# EAGLE design 8x8_matrix (EAGLE 8.2.2)
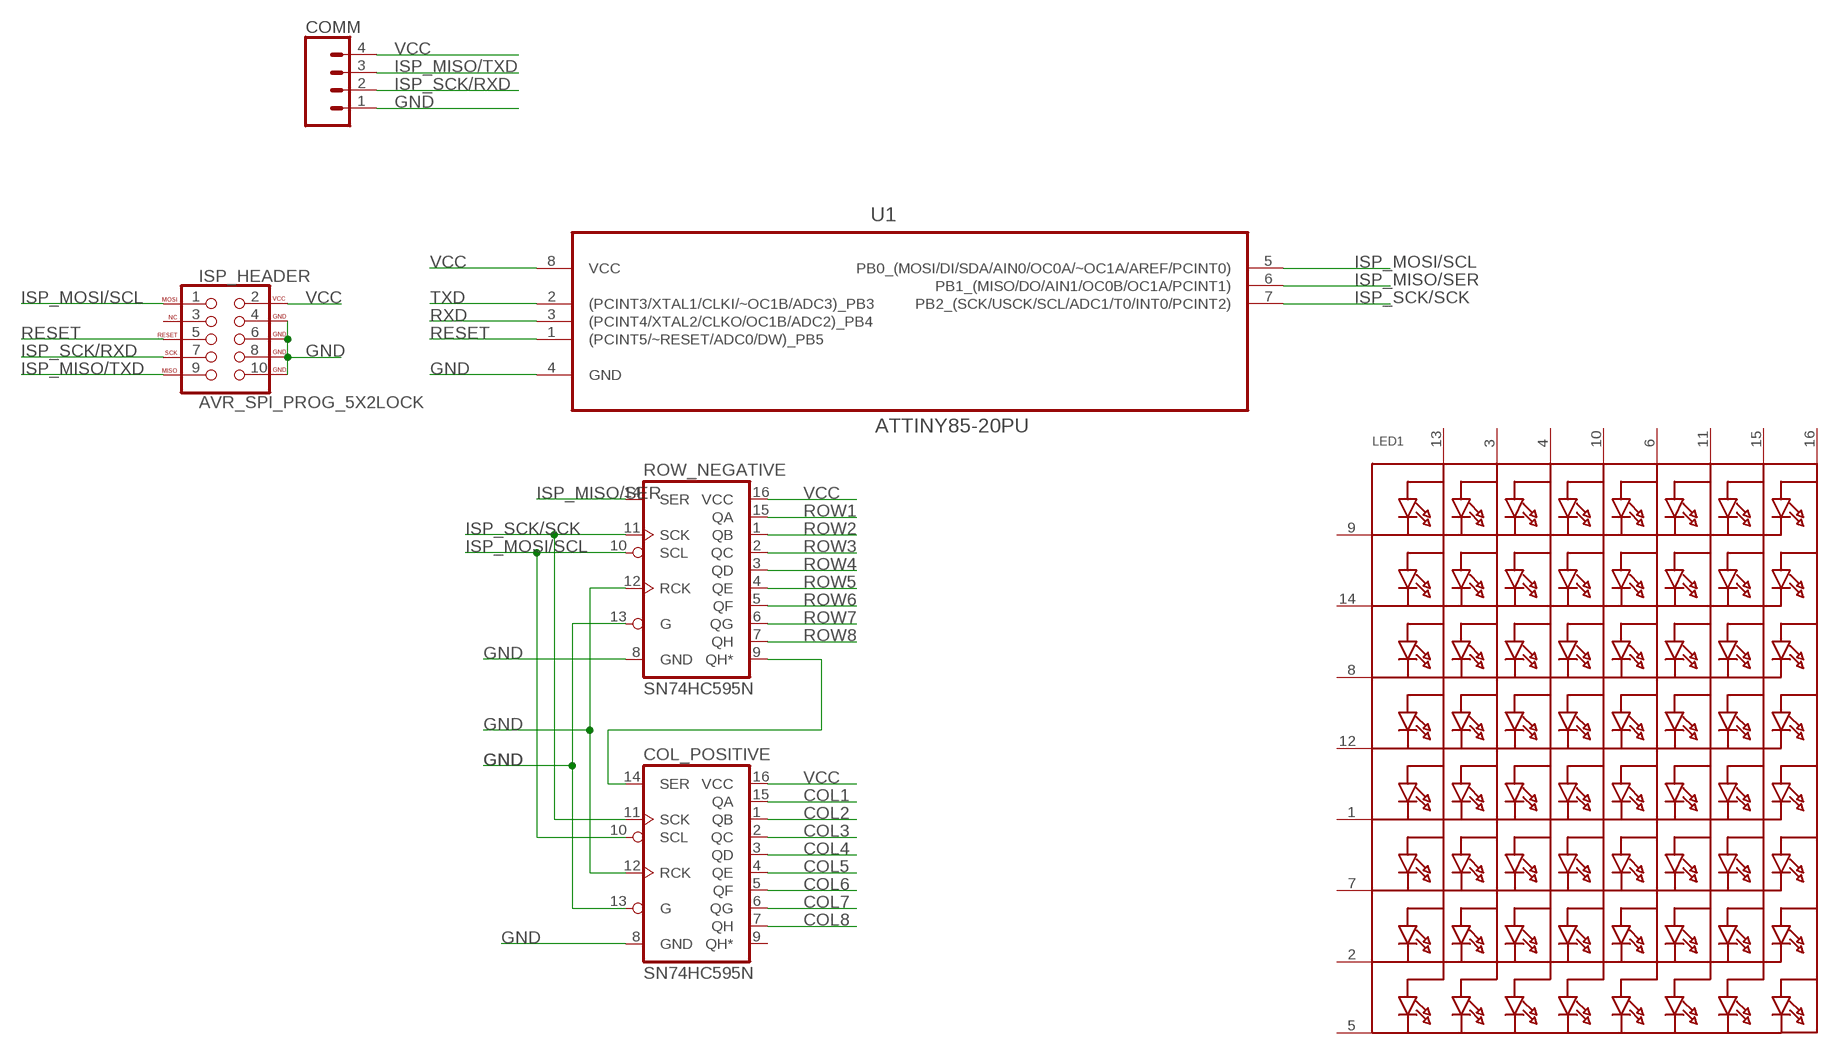
[diagram p0: schematic, sheet 1]

## Parts
COL_POSITIVE  SN74HC595N  74HC595N  [DIP16]
COMM  CONN_04POLAR  [MOLEX-1X4]
ISP_HEADER  AVR_SPI_PROG_5X2LOCK  [2X5-SHROUDED_LOCK]
LED1  SEGMENT_8X8_ROWCATHODEM12A881UR  [SEGMENT_BL-M12A881UR]
ROW_NEGATIVE  SN74HC595N  74HC595N  [DIP16]
U1  ATTINY85-20PU  [DIP254P762X533-8]

## Nets
COL1: COL_POSITIVE.15(QA)
COL2: COL_POSITIVE.1(QB)
COL3: COL_POSITIVE.2(QC)
COL4: COL_POSITIVE.3(QD)
COL5: COL_POSITIVE.4(QE)
COL6: COL_POSITIVE.5(QF)
COL7: COL_POSITIVE.6(QG)
COL8: COL_POSITIVE.7(QH)
GND: COL_POSITIVE.8(GND) COL_POSITIVE.12(RCK) COL_POSITIVE.13(G) COMM.1 ISP_HEADER.4(GND) ISP_HEADER.6(GND) ISP_HEADER.8(GND) ISP_HEADER.10(GND) ROW_NEGATIVE.8(GND) ROW_NEGATIVE.12(RCK) ROW_NEGATIVE.13(G) U1.4(GND)
ISP_MISO/SER: ROW_NEGATIVE.14(SER) U1.6(PB1_(MISO/DO/AIN1/OC0B/OC1A/PCINT1))
ISP_MISO/TXD: COMM.3 ISP_HEADER.9(MISO)
ISP_MOSI/SCL: COL_POSITIVE.10(SCL) ISP_HEADER.1(MOSI) ROW_NEGATIVE.10(SCL) U1.5(PB0_(MOSI/DI/SDA/AIN0/OC0A/~OC1A/AREF/PCINT0))
ISP_SCK/RXD: COMM.2 ISP_HEADER.7(SCK)
ISP_SCK/SCK: COL_POSITIVE.11(SCK) ROW_NEGATIVE.11(SCK) U1.7(PB2_(SCK/USCK/SCL/ADC1/T0/INT0/PCINT2))
N$3: COL_POSITIVE.14(SER) ROW_NEGATIVE.9(QH*)
RESET: ISP_HEADER.5(RESET) U1.1((PCINT5/~RESET/ADC0/DW)_PB5)
ROW1: ROW_NEGATIVE.15(QA)
ROW2: ROW_NEGATIVE.1(QB)
ROW3: ROW_NEGATIVE.2(QC)
ROW4: ROW_NEGATIVE.3(QD)
ROW5: ROW_NEGATIVE.4(QE)
ROW6: ROW_NEGATIVE.5(QF)
ROW7: ROW_NEGATIVE.6(QG)
ROW8: ROW_NEGATIVE.7(QH)
RXD: U1.3((PCINT4/XTAL2/CLKO/OC1B/ADC2)_PB4)
TXD: U1.2((PCINT3/XTAL1/CLKI/~OC1B/ADC3)_PB3)
VCC: COL_POSITIVE.16(VCC) COMM.4 ISP_HEADER.2(VCC) ROW_NEGATIVE.16(VCC) U1.8(VCC)
Unconnected: COL_POSITIVE.9(QH*) ISP_HEADER.3(NC) LED1.1(K5) LED1.2(K7) LED1.3(A2) LED1.4(A3) LED1.5(K8) LED1.6(A5) LED1.7(K6) LED1.8(K3) LED1.9(K1) LED1.10(A4) LED1.11(A6) LED1.12(K4) LED1.13(A1) LED1.14(K2) LED1.15(A7) LED1.16(A8)

## Library data of the parts
COL_POSITIVE ROW_NEGATIVE = SparkFun-IC-Logic:74*595: 8-Bit Shift Register (Serial to Parallel) Datasheet <http://cdn.sparkfun.com/datasheets/BreakoutBoards/MM74HC595.pdf> SparkFun Products SparkFun Shift Register Breakout - 74HC595 <https://www.sparkfun.com/products/10680> (BOB-10680); PROD_ID: IC-13123
COMM = SparkFun-Connectors:CONN_04: Multi connection point. Often used as Generic Header-pin footprint for 0.1 inch spaced/style header connections On any of the 0.1 inch spaced packages, you can populate with these: Break Away Headers - Straight <https://www.sparkfun.com/products/116> (PRT-00116) Break Away Male Headers - Right Angle <https://www.sparkfun.com/products/553> (PRT-00553) Female Headers <https://www.sparkfun.com/products/115> (PRT-00115) Break Away Headers - Machine Pin <https://www.sparkfun.com/products/117> (PRT-00117) Break Away Female Headers - Swiss Machine Pin <https://www.sparkfun.com/products/743> (PRT-00743) For SCREWTERMINALS and SPRING TERMINALS visit here: Screw Terimnals on SparkFun.com <https://www.sparkfun.com/search/results?term=Screw+Terminals> (5mm/3.5mm/2.54mm spacing) This device is also useful as a general connection point to wire up your design to another part of your project. Our various solder wires solder well into these plated through hole pads. Hook-Up Wire - Assortment (Stranded, 22 AWG) <https://www.sparkfun.com/products/11375> (PRT-11375) Hook-Up Wire - Assortment (Solid Core, 22 AWG) <https://www.sparkfun.com/products/11367> (PRT-11367) View the entire wire category on our website here <https://www.sparkfun.com/categories/141> Special notes: Molex polarized connector foot print use with SKU : PRT-08231 with associated crimp pins and housings. 1MM SMD Version SKU: PRT-10208; PROD_ID: CONN-08186; SF_ID: PRT-08231
ISP_HEADER = SparkFun-Connectors:AVR_SPI_PROG_5X2: AVR 10-pin ICSP Header This is the standard AVR In Circuit Serial Programming header. Minimal, but includes pin one indicator. Works with standard Olimex programmers. SparkFun Products: 2x5 AVR ICSP Male Header <https://www.sparkfun.com/products/778> - PTH 2x5 Pin Shrouded Header <https://www.sparkfun.com/products/8506> - PTH2; PROD_ID: CONN-08671; SF_ID: PRT-08506
LED1 = adafruit:SEGMENT_8X8_ROWCATHODE: 8x8 LED Segment Displays: Row = Cathode 0.7" Red 8X8 Matrix, 1.9mm Round LEDs - BL-M07C881UR 1.2" Red 8x8 Matrix, 3.0mm Round LEDs - BL-M12A881UR 1.2" Red 8x8 Matrix, 3.0mm Square LEDs - BL-M12A883
U1 = Atmel_By_element14_Batch_1-00:ATTINY85-20PU: 8-bit Microcontroller with In-System Programmable Flash; MPN: ATTINY85-20PU; OC_FARNELL: 1455162; OC_NEWARK: 58M3796; PACKAGE: PDIP-8; SUPPLIER: Atmel

## Board
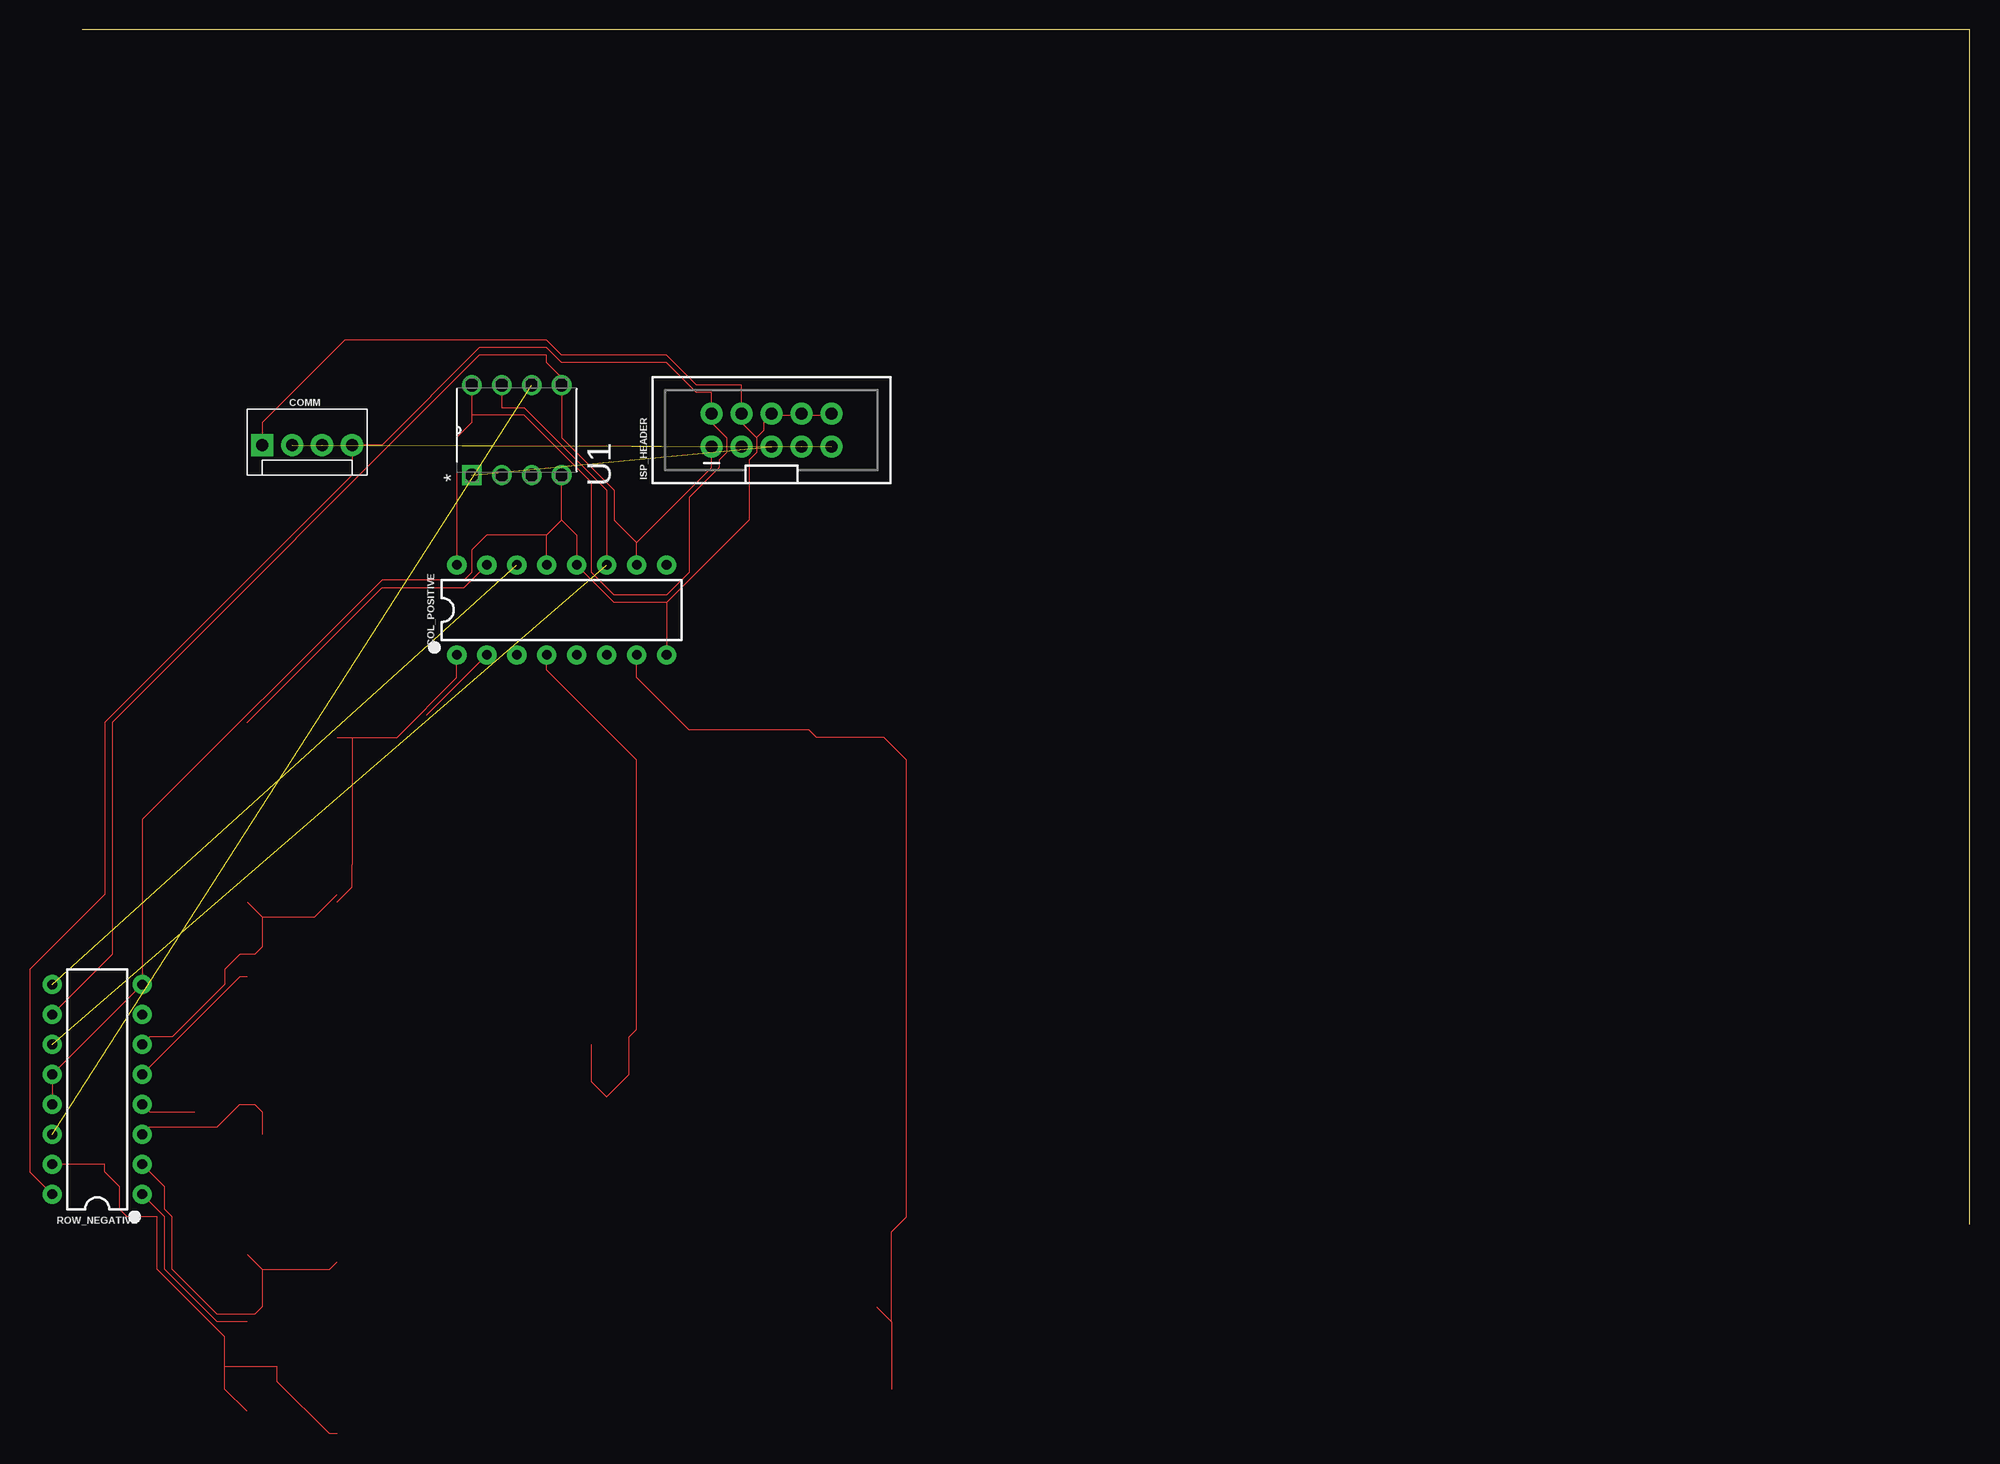
[diagram p1: board, top side]
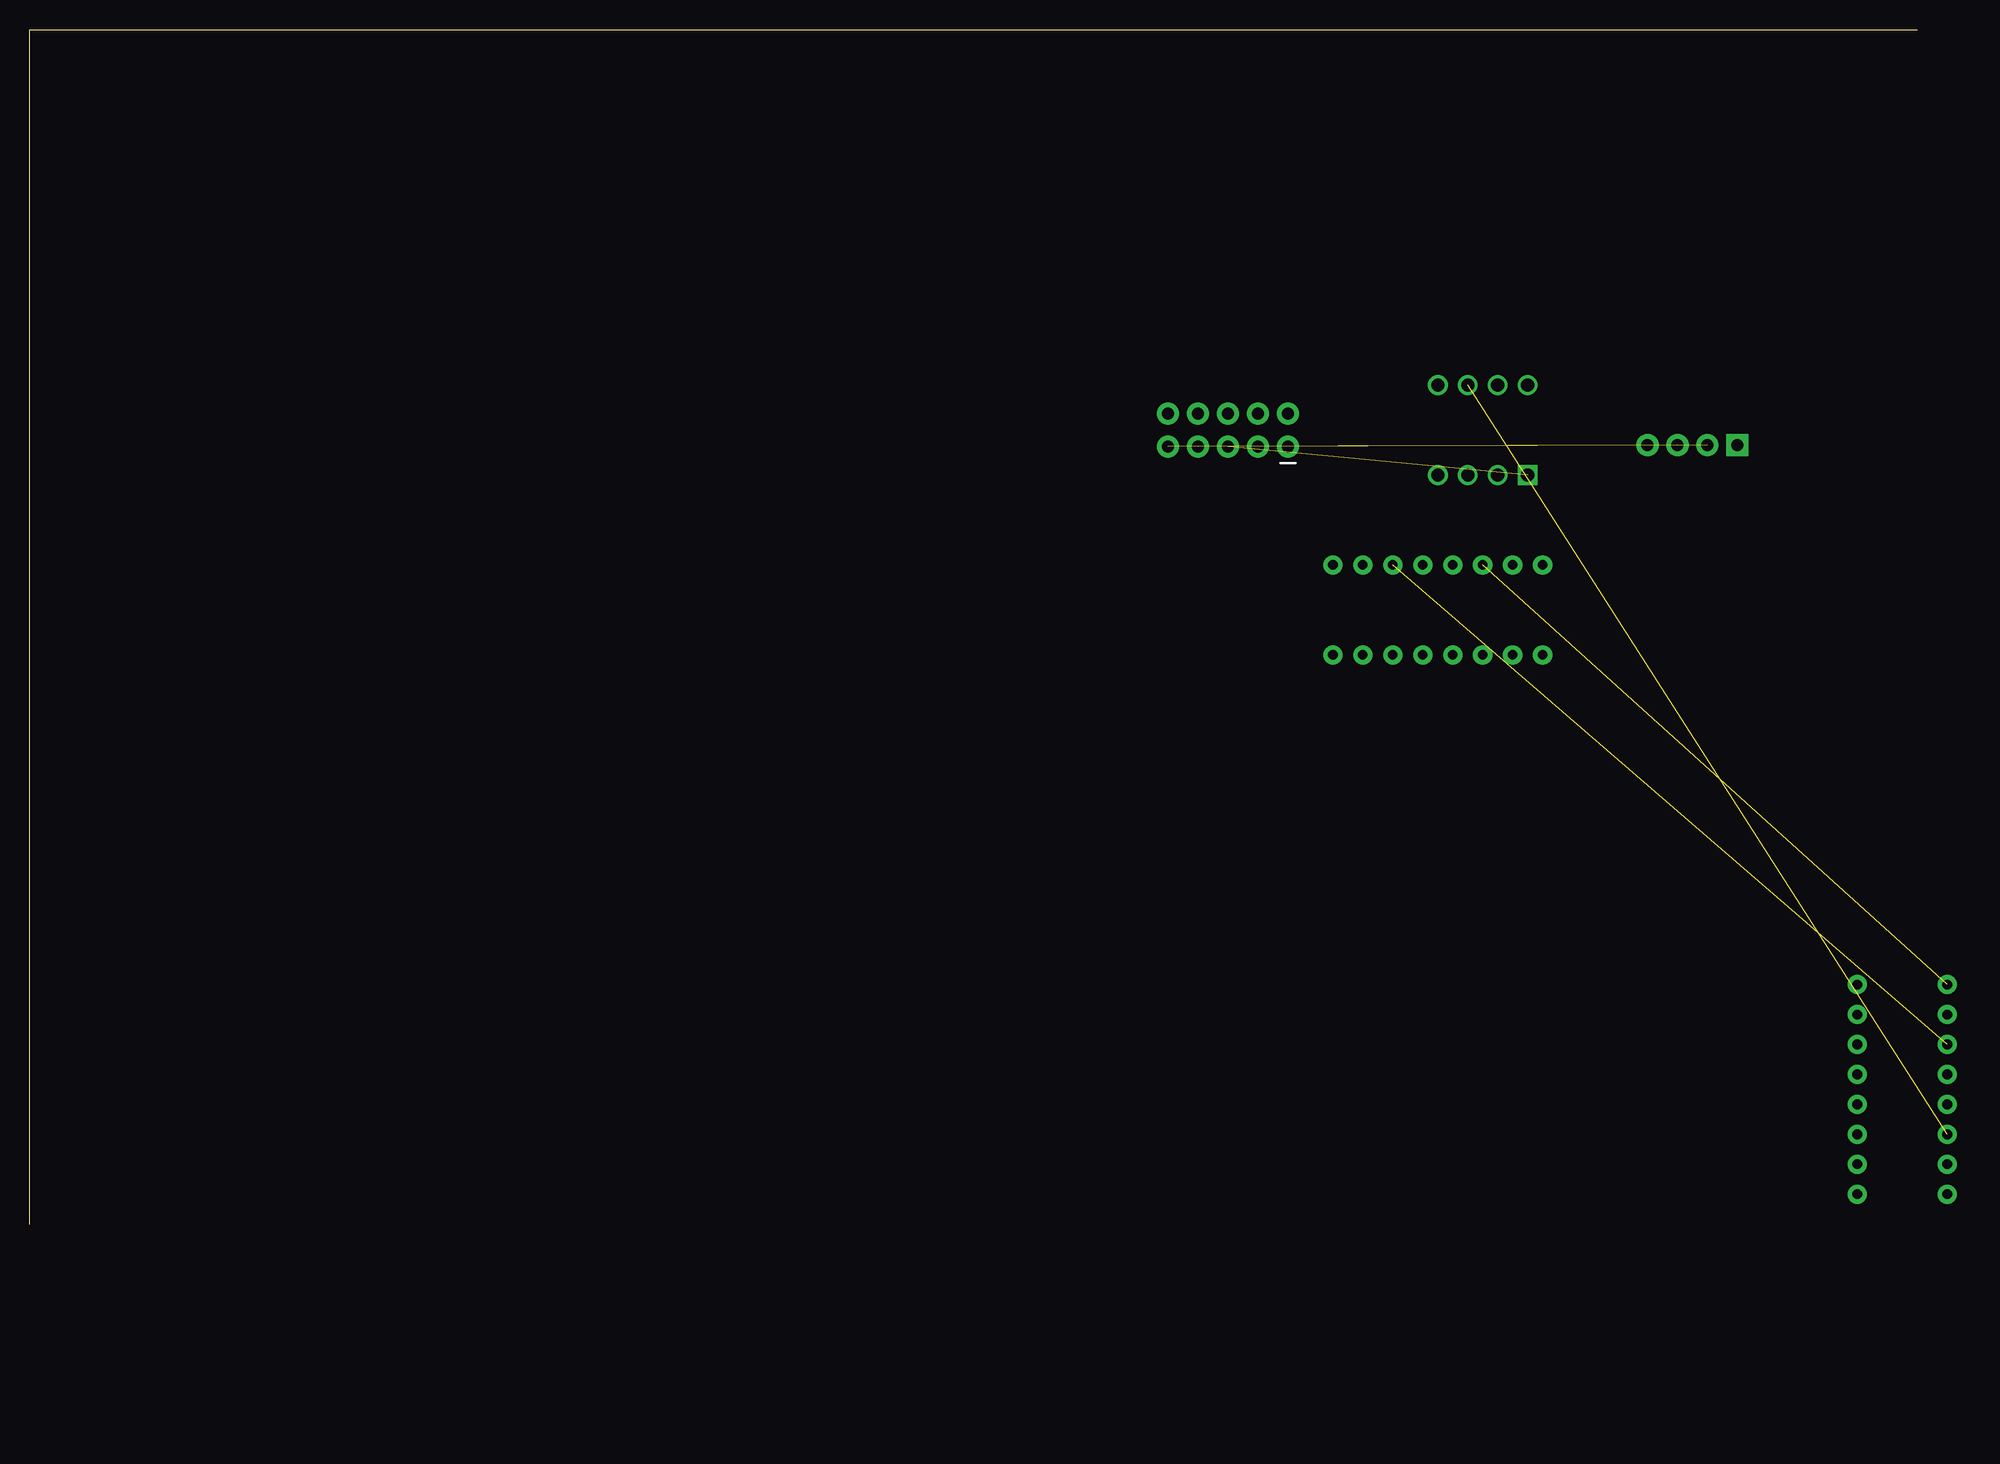
[diagram p2: board, bottom side, seen from below]

Size 160 x 101.27 mm. Coordinates in mm from the lower left corner, seen from the top.
Outline: 160,0 160,101.27 0,101.27
Copper layers (1*16): Top 0.035mm / dielectric 1.5mm / Bottom 0.035mm
Design rules "default *": minimum track width 1mil, minimum drill 24mil, track to track 1mil, track to pad 8mil, pad to pad 8mil, via to via 8mil, smd to smd 8mil, copper to edge 1mm, drill to drill 8mil, minimum pad ring 10mil, minimum via ring 8mil, stop-mask expansion 4mil, vias tented up to drill 0mil, thermal gap 10mil

### Footprints (pad centres in the part's own frame; a part is rotated, then mirrored left to right if it is on the bottom)
DIP16 = drill 0.813 pad 1.626: 1 -8.89,-3.81; 2 -6.35,-3.81; 3 -3.81,-3.81; 4 -1.27,-3.81; 5 1.27,-3.81; 6 3.81,-3.81; 7 6.35,-3.81; 8 8.89,-3.81; 9 8.89,3.81; 10 6.35,3.81; 11 3.81,3.81; 12 1.27,3.81; 13 -1.27,3.81; 14 -3.81,3.81; 15 -6.35,3.81; 16 -8.89,3.81
MOLEX-1X4 = drill 1.016 pad 1.88 square: 1 0,0 | drill 1.016 pad 1.88: 2 2.54,0; 3 5.08,0; 4 7.62,0
2X5-SHROUDED_LOCK = drill 1.016 pad 1.88: 1 -1.397,5.08; 2 1.397,5.08; 3 -1.397,2.54; 4 1.397,2.54; 5 -1.397,0; 6 1.397,0; 7 -1.397,-2.54; 8 1.397,-2.54; 9 -1.397,-5.08; 10 1.397,-5.08
SEGMENT_BL-M12A881UR = drill 0.8 pad 1.676: 1 -8.89,-12; 2 -6.35,-12; 3 -3.81,-12; 4 -1.27,-12; 5 1.27,-12; 6 3.81,-12; 7 6.35,-12; 8 8.89,-12; 9 8.89,12; 10 6.35,12; 11 3.81,12; 12 1.27,12; 13 -1.27,12; 14 -3.81,12; 15 -6.35,12; 16 -8.89,12
DIP254P762X533-8 = drill 1.118 square: 1 -7.62,7.62 | drill 1.118: 2 -7.62,5.08; 3 -7.62,2.54; 4 -7.62,0; 5 0,0; 6 0,2.54; 7 0,5.08; 8 0,7.62

### Placement (x,y rotation side)
COL_POSITIVE  40.64,52.07 0 top
COMM  15.24,66.04 0 top
ISP_HEADER  58.42,67.31 90 top
LED1  -27.94,-5.08 0 top  (outside the outline)
ROW_NEGATIVE  1.27,11.43 90 top
U1  40.64,71.12 90 top

### Tracks (layer width: path | path; a pad name or v marks a point on that pad's centre or on a via)
COL1
  Top 0.025: COL_POSITIVE.15 32.38,53.98 25.4,53.98 13.97,42.55
COL2
  Top 0.025: 21.59,27.3 22.86,28.57 22.86,30.48 22.86,41.28 | COL_POSITIVE.1 31.75,46.36 26.67,41.28 22.86,41.28 | 21.59,41.28 22.86,41.28
COL3
  Top 0.025: 29.21,43.18 COL_POSITIVE.2
COL5
  Top 0.025: COL_POSITIVE.4 39.37,46.99 46.99,39.37 46.99,16.51 46.35,15.88 46.35,12.7 44.45,10.79 43.18,12.06 43.18,15.24
COL8
  Top 0.025: 68.58,-8.26 68.58,-13.97 | 67.31,-6.99 68.58,-8.26 | COL_POSITIVE.7 46.99,46.36 51.44,41.91 61.59,41.91 62.23,41.28 67.94,41.28 69.85,39.37 69.85,0.64 68.58,-0.64 68.58,-8.26
GND
  Top 0.025: ROW_NEGATIVE.13 ROW_NEGATIVE.12 -2.54,13.33 -1.91,13.33 ROW_NEGATIVE.8 5.08,34.29 25.4,54.61 32.38,54.61 33.02,55.25 33.02,57.15 34.29,58.42 39.37,58.42 | 40.64,59.69 U1.4 | 39.37,58.42 40.64,59.69 | COL_POSITIVE.13 39.37,58.42 | 40.64,59.69 41.91,58.42 COL_POSITIVE.12 45.09,52.71 49.53,52.71 | 49.53,52.71 COL_POSITIVE.8 | 49.53,52.71 56.52,59.69 56.52,64.77 57.15,65.41 57.15,66.67 | 57.15,66.67 55.88,67.94 ISP_HEADER.4 55.88,71.12 52.07,71.12 49.53,73.66 40.64,73.66 39.37,74.93 22.23,74.93 15.24,67.94 COMM.1 | 58.42,68.58 57.78,67.94 57.78,67.31 57.15,66.67 | 58.42,68.58 60.96,68.58 | 58.42,68.58 ISP_HEADER.6 | 60.96,68.58 63.5,68.58 ISP_HEADER.10 | 60.96,68.58 ISP_HEADER.8
ISP_MISO/SER  (1 unrouted)
ISP_MISO/TXD  (1 unrouted)
ISP_MOSI/SCL
  Top 0.025: ISP_HEADER.1 53.34,64.14 46.99,57.79 | COL_POSITIVE.10 46.99,57.79 | ROW_NEGATIVE.10 2.54,22.86 2.54,42.55 33.66,73.66 39.37,73.66 39.37,73.02 40.64,71.75 U1.5 40.64,66.67 45.09,62.23 45.09,59.69 46.99,57.79
ISP_SCK/RXD  (1 unrouted)
ISP_SCK/SCK  (1 unrouted)
  Top 0.025: COL_POSITIVE.11 44.45,62.23 37.47,69.21 35.56,69.21 U1.7
N$3  (1 unrouted)
RESET  (1 unrouted)
ROW1
  Top 0.025: ROW_NEGATIVE.15 1.91,5.08 1.91,4.45 3.17,3.17 3.17,1.27 3.81,0.64 6.35,0.64 6.35,-3.81 12.06,-9.53 12.06,-12.07 | 12.06,-12.07 12.06,-13.97 13.97,-15.88 | 12.06,-12.07 16.51,-12.07 16.51,-13.34 20.95,-17.78 21.59,-17.78
ROW2
  Top 0.025: ROW_NEGATIVE.1 6.99,0.64 6.99,-3.81 11.43,-8.26 13.97,-8.26
ROW3
  Top 0.025: ROW_NEGATIVE.2 6.99,3.17 6.99,1.27 7.62,0.64 7.62,-3.81 11.43,-7.62 14.61,-7.62 15.24,-6.99 15.24,-3.81 | 13.97,-2.54 15.24,-3.81 | 21.59,-3.18 20.95,-3.81 15.24,-3.81
ROW4
  Top 0.025: 15.24,7.62 15.24,9.53 14.61,10.16 13.34,10.16 11.43,8.26 5.08,8.26 ROW_NEGATIVE.3
ROW5
  Top 0.025: 9.53,9.53 5.71,9.53 ROW_NEGATIVE.4
ROW6
  Top 0.025: ROW_NEGATIVE.5 13.34,20.95 13.97,20.95
ROW7
  Top 0.025: ROW_NEGATIVE.6 5.71,15.88 7.62,15.88 12.06,20.32 12.06,21.59 13.34,22.86 14.61,22.86 15.24,23.5 15.24,26.04 | 13.97,27.3 15.24,26.04 | 21.59,27.94 19.68,26.04 15.24,26.04
VCC
  Top 0.025: COL_POSITIVE.16 31.75,66.67 33.02,67.94 33.02,68.58 | U1.8 33.02,68.58 | ROW_NEGATIVE.16 -4.45,4.45 -4.45,21.59 1.91,27.94 1.91,42.55 22.86,63.5 COMM.4 25.4,66.04 33.66,74.3 39.37,74.3 40.64,73.02 49.53,73.02 52.07,70.48 53.34,70.48 ISP_HEADER.2 53.34,67.94 54.61,66.67 54.61,65.41 53.98,64.77 53.98,64.14 51.44,61.6 51.44,55.25 49.53,53.34 45.09,53.34 43.18,55.25 43.18,62.87 37.47,68.58 33.02,68.58